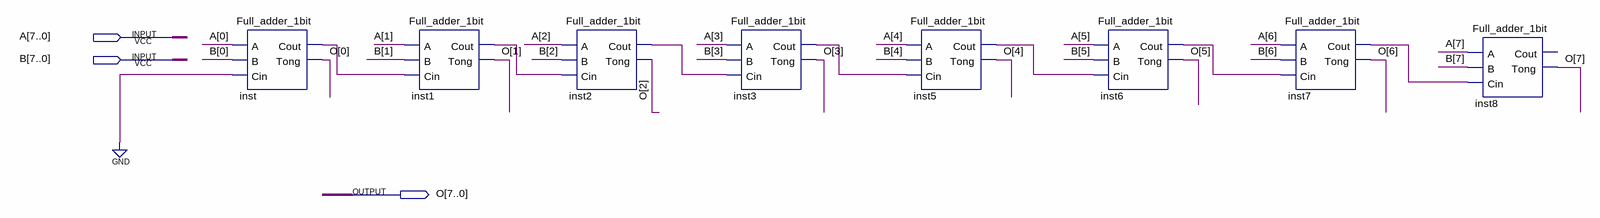
[diagram p0: schematic sheet]
// Quartus schematic add_8bits.bdf as structural Verilog: 8 symbols, 3 pins
module add_8bits (
  input  [7:0] A,
  input  [7:0] B,
  output [7:0] O
);

  wire inst1_cout, inst2_cout, inst3_cout, inst5_cout, inst6_cout, inst7_cout, inst_cout;

  Full_adder_1bit inst (.A(A[0]), .B(B[0]), .Cin(1'b0), .Cout(inst_cout), .Tong(O[0]));
  Full_adder_1bit inst1 (.A(A[1]), .B(B[1]), .Cin(inst_cout), .Cout(inst1_cout), .Tong(O[1]));
  Full_adder_1bit inst2 (.A(A[2]), .B(B[2]), .Cin(inst1_cout), .Cout(inst2_cout), .Tong(O[2]));
  Full_adder_1bit inst3 (.A(A[3]), .B(B[3]), .Cin(inst2_cout), .Cout(inst3_cout), .Tong(O[3]));
  Full_adder_1bit inst5 (.A(A[4]), .B(B[4]), .Cin(inst3_cout), .Cout(inst5_cout), .Tong(O[4]));
  Full_adder_1bit inst6 (.A(A[5]), .B(B[5]), .Cin(inst5_cout), .Cout(inst6_cout), .Tong(O[5]));
  Full_adder_1bit inst7 (.A(A[6]), .B(B[6]), .Cin(inst6_cout), .Cout(inst7_cout), .Tong(O[6]));
  Full_adder_1bit inst8 (.A(A[7]), .B(B[7]), .Cin(inst7_cout), .Tong(O[7]));  // open: Cout
endmodule
